# EAGLE design schematic_V3 (EAGLE 9.6.1)
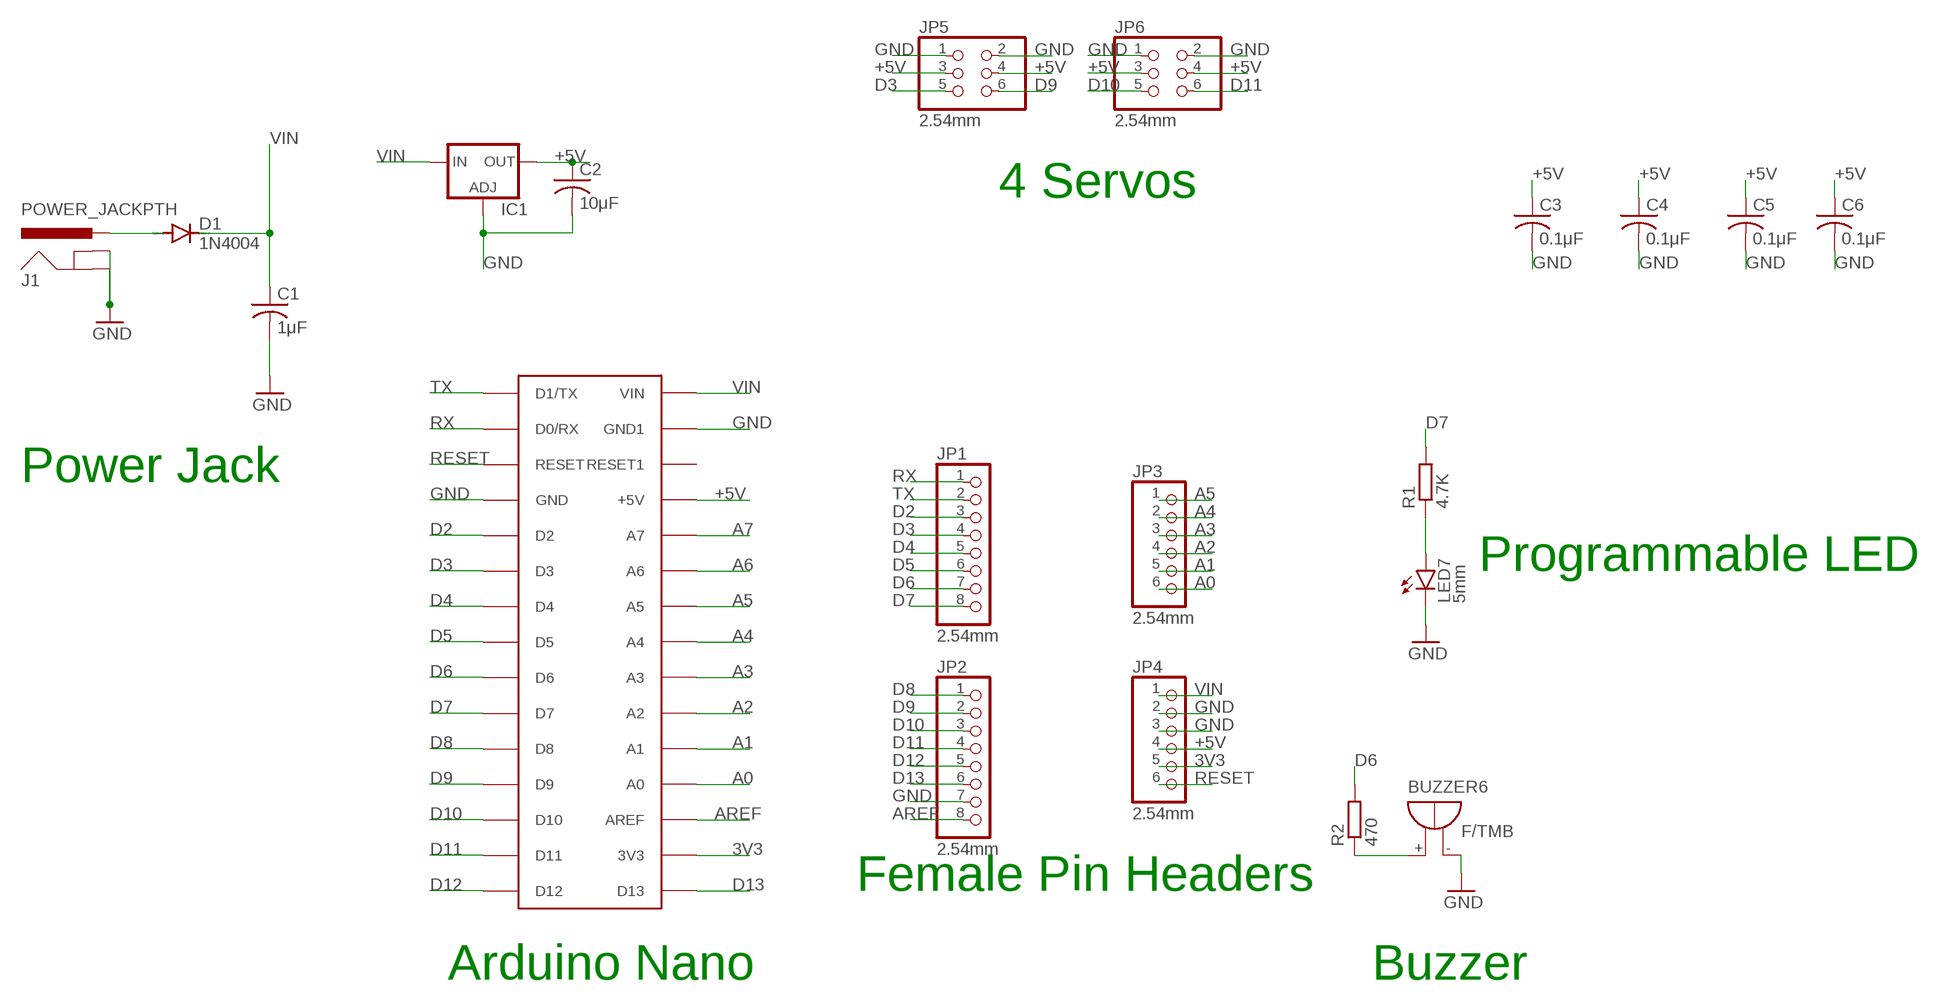
[diagram p0: schematic, sheet 1]

## Parts
BUZZER6  F/TMB  [F/TMB]
C1  1μF  C-USC1206  [C1206]
C2  10μF  C-USC1206  [C1206]
C3  0.1μF  C-USC1206  [C1206]
C4  0.1μF  C-USC1206  [C1206]
C5  0.1μF  C-USC1206  [C1206]
C6  0.1μF  C-USC1206  [C1206]
D1  1N4004  [DO41-10]
IC1  VR1  LD117AS33TR  [SOT223]
J1  POWER_JACKPTH  [POWER_JACK_PTH]
JP1  2.54mm  PINHD-1X8  [1X08]
JP2  2.54mm  PINHD-1X8  [1X08]
JP3  2.54mm  PINHD-1X6  [1X06]
JP4  2.54mm  PINHD-1X6  [1X06]
JP5  2.54mm  PINHD-2X3  [2X03]
JP6  2.54mm  PINHD-2X3  [2X03]
LED7  5mm  LED5MM  [LED5MM]
R1  4.7K  R-EU_0207/10  [0207/10]
R2  470  R-EU_0207/10  [0207/10]
U$1  ARDUINONANO  [PDIP-32]

## Nets
3V3: JP4.5 U$1.3V3
+5V: C2.1 C3.1 C4.1 C5.1 C6.1 IC1.4(OUT) JP4.4 JP5.3 JP5.4 JP6.3 JP6.4 U$1.+5V
A0: JP3.6 U$1.A7(A0)
A1: JP3.5 U$1.A6(A1)
A2: JP3.4 U$1.A5(A2)
A3: JP3.3 U$1.A4(A3)
A4: JP3.2 U$1.A3(A4)
A5: JP3.1 U$1.A2(A5)
A6: U$1.A1(A6)
A7: U$1.A0(A7)
AREF: JP2.8 U$1.AREF
D2: JP1.3 U$1.D2
D3: JP1.4 JP5.5 U$1.D3
D4: JP1.5 U$1.D4
D5: JP1.6 U$1.D5
D6: JP1.7 R2.2 U$1.D6
D7: JP1.8 R1.2 U$1.D7
D8: JP2.1 U$1.D8
D9: JP2.2 JP5.6 U$1.D9
D10: JP2.3 JP6.5 U$1.D10
D11: JP2.4 JP6.6 U$1.D11
D12: JP2.5 U$1.D12
D13: JP2.6 U$1.D13
GND: BUZZER6.- C1.2 C2.2 C3.2 C4.2 C5.2 C6.2 IC1.1(ADJ) J1.GND J1.GNDBREAK JP2.7 JP4.2 JP4.3 JP5.1 JP5.2 JP6.1 JP6.2 LED7.K(C) U$1.GND U$1.GND1
N$1: LED7.A R1.1
N$2: D1.A J1.PWR
N$4: BUZZER6.+ R2.1
RESET: JP4.6 U$1.RESET
RX: JP1.1 U$1.D0/RX
TX: JP1.2 U$1.D1/TX
VIN: C1.1 D1.C IC1.3(IN) JP4.1 U$1.VIN
Unconnected: U$1.RESET1

## Notes on the sheet
- 4 Servos
- Power Jack
- Programmable LED
- Female Pin Headers
- Arduino Nano | Buzzer

## Library data of the parts
BUZZER6 = buzzer:F/TMB: BUZZER Source: Buerklin; OC_FARNELL: unknown; OC_NEWARK: unknown
C1-C6 = adafruit:C-US: CAPACITOR, American symbol
D1 = diode:1N4004: DIODE general purpose rectifier, 1 A
IC1 = v-reg:LD117A?*: Low drop fixed and adjustable positive voltage regulators 1 A Source: http://www.st.com/stonline/products/literature/ds/7194/ld1117axx.pdf
J1 = SparkFun:POWER_JACK: Power Jack This is the standard 5.5mm barrel jack for power. The PTH is the most common, proven, reliable, footprint. All others are experimental. The Slot footprint only works if the mill layer is transmitted to the PCB fab house so be warned. Spark Fun Electronics SKU : PRT-00119. Mating wall wart : TOL-00298 (and others)
JP1 JP2 = pinhead:PINHD-1X8: PIN HEADER
JP3 JP4 = pinhead:PINHD-1X6: PIN HEADER
JP5 JP6 = pinhead:PINHD-2X3: PIN HEADER
LED7 = led:LED: LED OSRAM: - CHIPLED LG R971, LG N971, LY N971, LG Q971, LY Q971, LO R971, LY R971 LH N974, LH R974 LS Q976, LO Q976, LY Q976 LO Q996 - Hyper CHIPLED LW Q18S LB Q993, LB Q99A, LB R99A - SideLED LS A670, LO A670, LY A670, LG A670, LP A670 LB A673, LV A673, LT A673, LW A673 LH A674 LY A675 LS A676, LA A676, LO A676, LY A676, LW A676 LS A679, LY A679, LG A679 - Hyper Micro SIDELED® LS Y876, LA Y876, LO Y876, LY Y876 LT Y87S - SmartLED LW L88C, LW L88S LB L89C, LB L89S, LG L890 LS L89K, LO L89K, LY L89K LS L896, LA L896, LO L896, LY L896 - TOPLED LS T670, LO T670, LY T670, LG T670, LP T670 LSG T670, LSP T670, LSY T670, LOP T670, LYG T670 LG T671, LOG T671, LSG T671 LB T673, LV T673, LT T673, LW T673 LH T674 LS T676, LA T676, LO T676, LY T676, LB T676, LH T676, LSB T676, LW T676 LB T67C, LV T67C, LT T67C, LS T67K, LO T67K, LY T67K, LW E67C LS E67B, LA E67B, LO E67B, LY E67B, LB E67C, LV E67C, LT E67C LW T67C LS T679, LY T679, LG T679 LS T770, LO T770, LY T770, LG T770, LP T770 LB T773, LV T773, LT T773, LW T773 LH T774 LS E675, LA E675, LY E675, LS T675 LS T776, LA T776, LO T776, LY T776, LB T776 LHGB T686 LT T68C, LB T68C - Hyper Mini TOPLED® LB M676 - Mini TOPLED Santana® LG M470 LS M47K, LO M47K, LY M47K Source: http://www.osram.convergy.de LUXEON: - LUMILED® LXK2-PW12-R00, LXK2-PW12-S00, LXK2-PW14-U00, LXK2-PW14-V00 LXK2-PM12-R00, LXK2-PM12-S00, LXK2-PM14-U00 LXK2-PE12-Q00, LXK2-PE12-R00, LXK2-PE12-S00, LXK2-PE14-T00, LXK2-PE14-U00 LXK2-PB12-K00, LXK2-PB12-L00, LXK2-PB12-M00, LXK2-PB14-N00, LXK2-PB14-P00, LXK2-PB14-Q00 LXK2-PR12-L00, LXK2-PR12-M00, LXK2-PR14-Q00, LXK2-PR14-R00 LXK2-PD12-Q00, LXK2-PD12-R00, LXK2-PD12-S00 LXK2-PH12-R00, LXK2-PH12-S00 LXK2-PL12-P00, LXK2-PL12-Q00, LXK2-PL12-R00 Source: www.luxeon.com KINGBRIGHT: KA-3528ASYC Source: www.kingbright.com
R1 R2 = rcl:R-EU_: RESISTOR, European symbol; SPICEPREFIX: R
U$1 = rocketfarm:ARDUINONANO

## Board
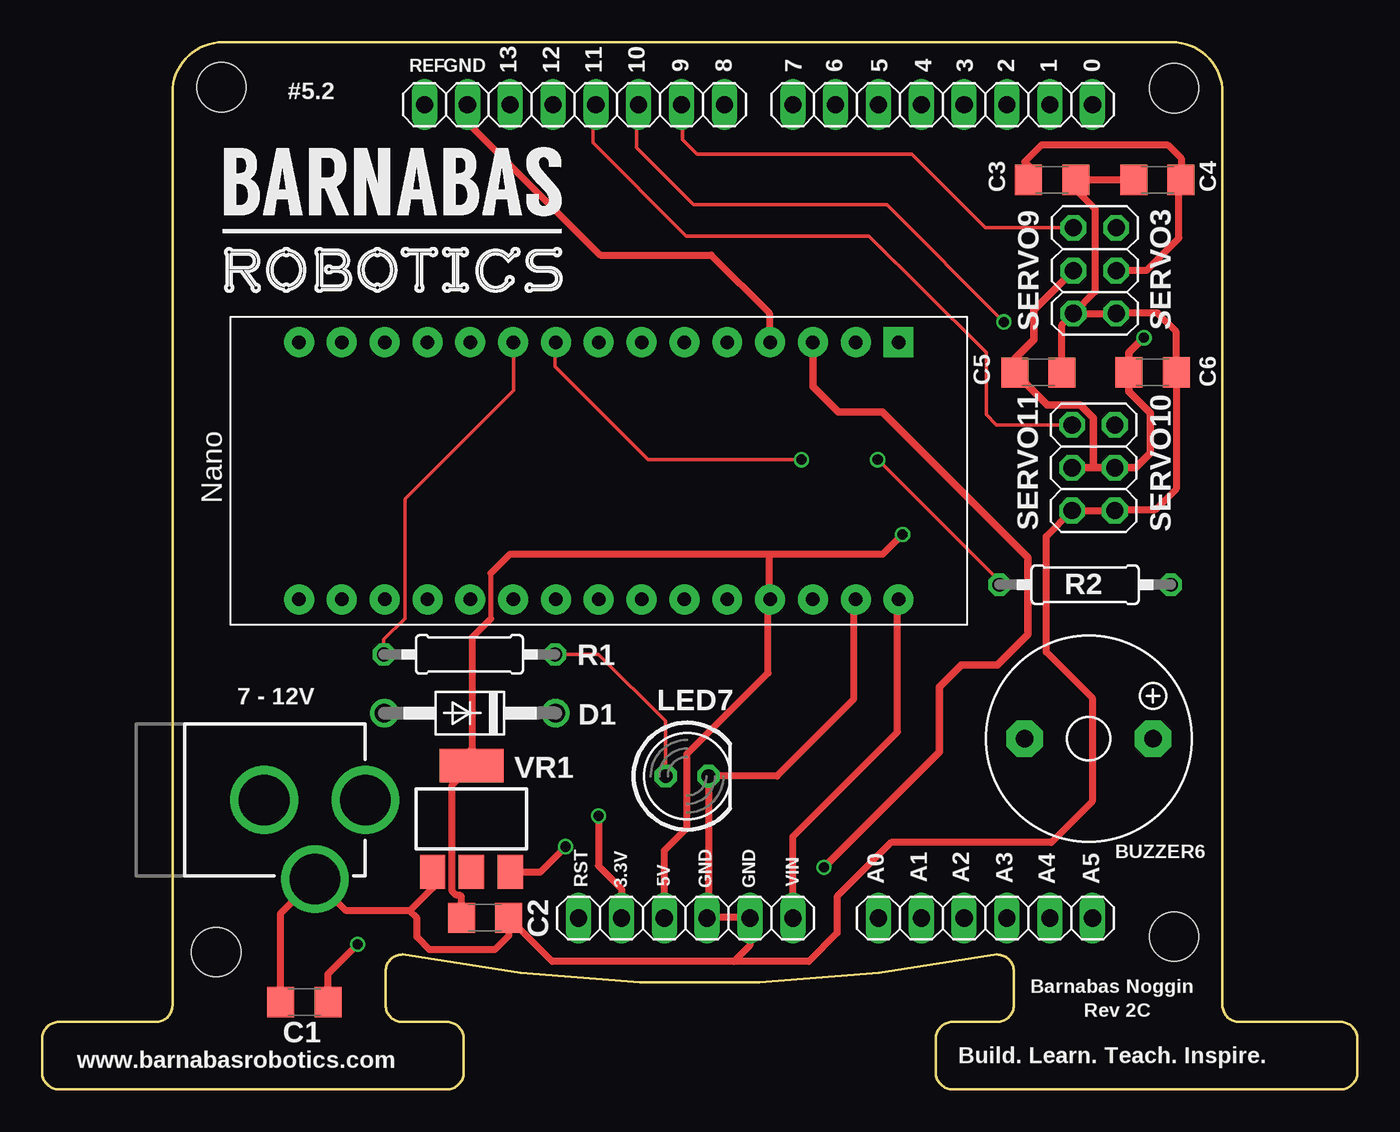
[diagram p1: board, top side]
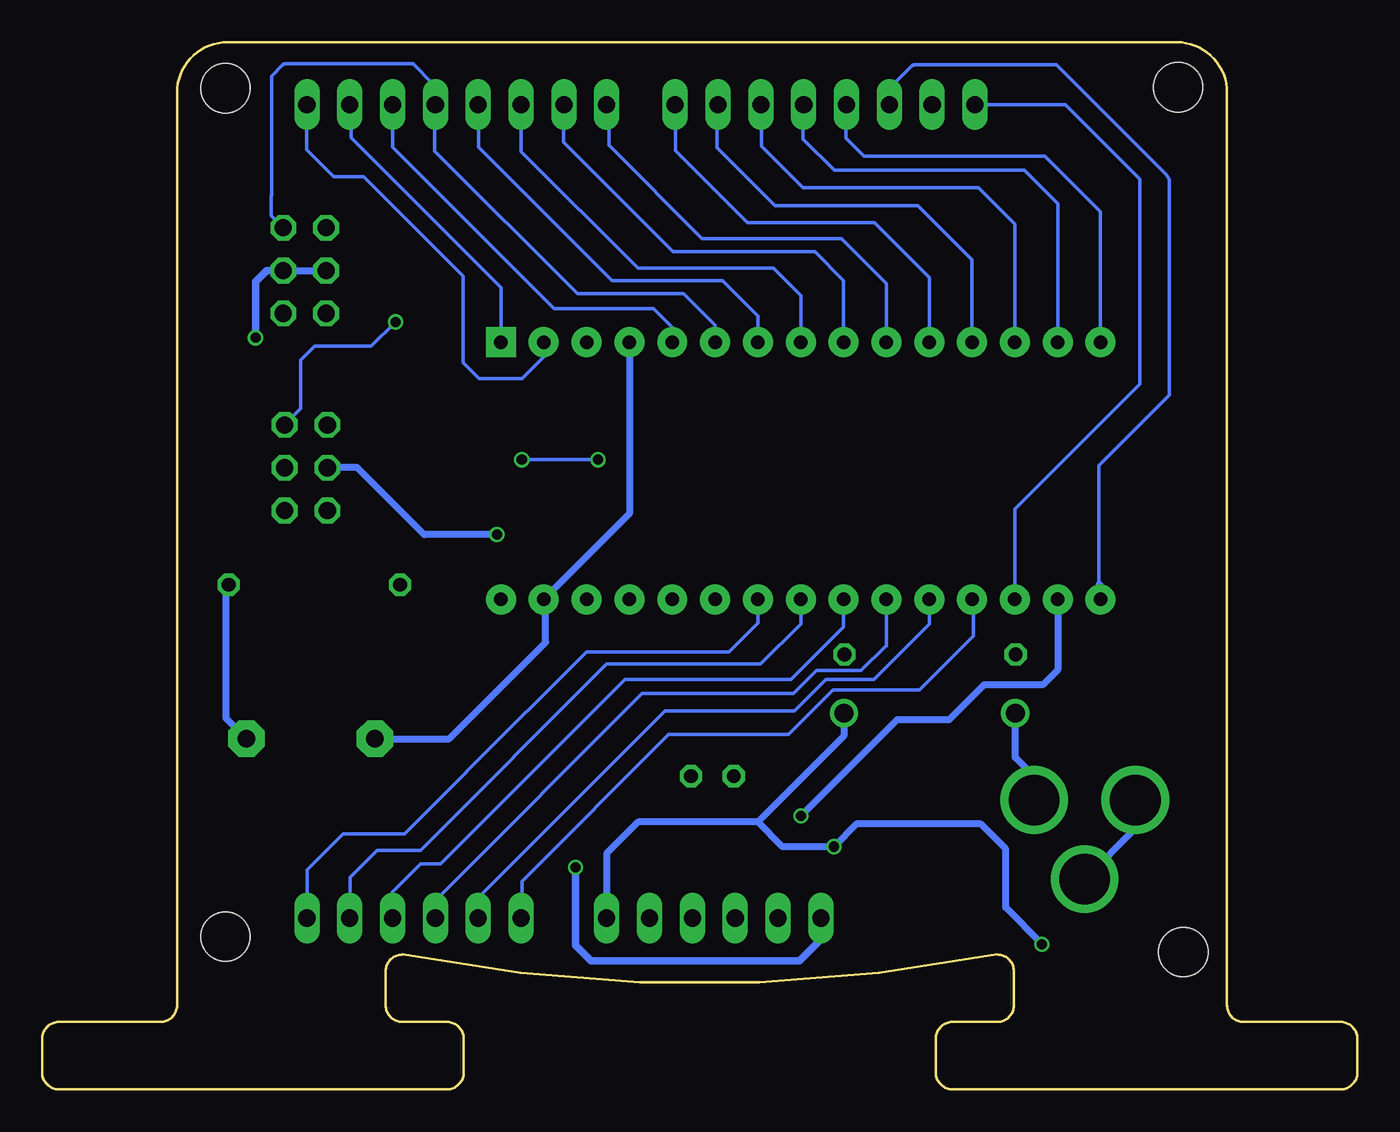
[diagram p2: board, bottom side, seen from below]

Size 78 x 62.12 mm. Coordinates in mm from the lower left corner, seen from the top.
Outline: 57.63,7 57.63,5 arc-90 56.63,4 54,4 arc90 53,3 53,1 arc90 54,0 77,0 arc90 78,1 78,3 arc90 77,4 71,4 arc-90 70,5 70,59.12 arc90 67,62.12 10.73,62.12 arc90 7.73,59.12 7.73,5 arc-90 6.73,4 1,4 arc90 0,3 0,1 arc90 1,0 24,0 arc90 25,1 25,3 arc90 24,4 21.37,4 arc-90 20.37,5 20.37,7 arc-90 21.37,8 arc22 56.63,8 arc-90 57.63,7
Copper layers (1*16): Top 0.035mm / dielectric 1.5mm / Bottom 0.035mm
Design rules "EagleRules": minimum track width 7mil, minimum drill 12mil, track to track 7mil, track to pad 7mil, pad to pad 7mil, via to via 7mil, smd to smd 0mil, copper to edge 20mil, drill to drill 10mil, minimum pad ring 10mil, minimum via ring 6mil, stop-mask expansion 2mil, vias tented up to drill 25mil, thermal gap 10mil
Holes 2.9 mm at 10.64,59.44 67.14,59.38 67.14,9.06 10.32,8.13

### Footprints (pad centres in the part's own frame; a part is rotated, then mirrored left to right if it is on the bottom)
F/TMB = drill 1.016 pad 2.159 octagon: + 3.81,0; - -3.81,0
C1206 = smd 1.6 x 1.8: 1 -1.4,0; 2 1.4,0
DO41-10 = drill 1.118: A 5.08,0; C -5.08,0
SOT223 = smd 1.5 x 2: 1 -2.3,-3.15; 2 0,-3.15; 3 2.3,-3.15 | smd 3.8 x 2: 4 0,3.15
POWER_JACK_PTH = drill 2.997: GND 0,7.7; GNDBREAK 4.7,10.7; PWR 0,13.7
1X08 = drill 1.016 long: 1 -8.89,0; 2 -6.35,0; 3 -3.81,0; 4 -1.27,0; 5 1.27,0; 6 3.81,0; 7 6.35,0; 8 8.89,0
1X06 = drill 1.016 long: 1 -6.35,0; 2 -3.81,0; 3 -1.27,0; 4 1.27,0; 5 3.81,0; 6 6.35,0
2X03 = drill 1.016 octagon: 1 -2.54,-1.27; 2 -2.54,1.27; 3 0,-1.27; 4 0,1.27; 5 2.54,-1.27; 6 2.54,1.27
LED5MM = drill 0.813 octagon: A -1.27,0; K 1.27,0
0207/10 = drill 0.813 octagon: 1 -5.08,0; 2 5.08,0
PDIP-32 = drill 0.8 pad 1.778: 3V3 15.24,-35.56; +5V 15.24,-10.16; A0 15.24,-12.7; A1 15.24,-15.24; A2 15.24,-17.78; A3 15.24,-20.32; A4 15.24,-22.86; A5 15.24,-25.4; A6 15.24,-27.94; A7 15.24,-30.48; AREF 15.24,-33.02; D0/RX 0,-5.08; D2 0,-12.7; D3 0,-15.24; D4 0,-17.78; D5 0,-20.32; D6 0,-22.86; D7 0,-25.4; D8 0,-27.94; D9 0,-30.48; D10 0,-33.02; D11 0,-35.56; D12 0,-38.1; D13 15.24,-38.1; GND 0,-10.16; GND1 15.24,-5.08; RESET 0,-7.62; RESET1 15.24,-7.62; VIN 15.24,-2.54 | drill 0.8 pad 1.778 square: D1/TX 0,-2.54

### Placement (x,y rotation side)
BUZZER6  62.07,20.8 0 top
C1  15.55,5.19 180 top
C2  26.26,10.18 0 top
C3  59.89,53.95 0 top
C4  66.14,53.95 180 top
C5  59.09,42.52 0 top
C6  65.86,42.52 0 top
D1  25.37,22.32 180 top
IC1  25.46,16.05 0 top
J1  5.47,17.17 270 top
JP1  53.41,58.41 180 top
JP2  31.57,58.41 180 top
JP3  55.95,10.16 180 top
JP4  38.17,10.16 180 top
JP5  62.43,48.57 90 top
JP6  62.35,36.87 90 top
LED7  38.25,18.58 0 top
R1  25.34,25.8 180 top
R2  61.86,29.94 180 top
U$1  53.33,44.31 270 top

### Tracks (layer width: path | path; a pad name or v marks a point on that pad's centre or on a via)
3V3  (via drill 0.6)
  Top 0.406: v33,16.23 33,13.26 34.35,11.91 JP4.5
  Bottom 0.406: U$1.3V3 17.77,24.89 18.66,24 22.14,24 24.22,21.92 27.3,21.92 30.73,18.49 v33,16.23
+5V  (via drill 0.6)
  Top 0.203: 58.66,53.95 58.76,53.85 | C5.1 57.69,42.38 | 65.72,37.74 65.73,37.75 | 61.08,36.95 JP6.4
  Top 0.305: 26.62,27.93 26.62,30.63
  Top 0.406: JP4.4 36.9,14.17 38.24,15.51 38.24,19.89 43.05,24.69 43.05,28.95 U$1.+5V 43.13,29.11 43.13,31.75 | 26.62,27.93 25.5,26.8 25.5,20.23 24.92,19.66 24.92,18.66 | 26.62,30.63 27.74,31.75 43.13,31.75 | 43.13,31.75 49.86,31.75 v51.03,32.91 | 58.76,53.85 58.48,53.85 58.27,54.05 | 58.27,55.01 59.28,56.02 66.75,56.02 67.55,55.22 C4.1 67.42,53.83 67.42,50.5 65.49,48.57 JP5.3 | C2.1 24.86,11.44 24.78,11.52 24.55,11.52 24.33,11.74 24.33,18.06 24.92,18.66 | 58.27,55.01 58.27,54.05 | 58.27,54.05 58.39,54.05 C3.1 58.49,54.79 58.27,55.01 | IC1.4 24.92,18.66
  Top 0.45: JP6.4 62.34,36.87 | 62.34,36.87 JP6.3 64.85,36.87 65.72,37.74 | 65.73,37.75 65.73,40.13 64.46,41.4 C6.1 64.46,43.7 v65.34,44.58 | JP5.4 58.81,46.22 58.81,44.47 57.69,43.35 57.69,42.38 | C5.1 59.63,40.58 61.56,40.58 62.34,39.8 62.34,36.87
  Bottom 0.203: 65.34,47.9 64.78,48.47 | 64.68,48.57 64.78,48.47 | 64.78,48.47 63.8,48.47 JP5.3
  Bottom 0.406: v51.03,32.91 55.35,32.91 59.33,36.9 61.05,36.9 JP6.4 | JP5.3 JP5.4
  Bottom 0.45: v65.34,44.58 65.34,47.9 64.68,48.57 JP5.3
A0
  Bottom 0.203: U$1.A7 22.85,28.82 | JP3.6 49.54,10.22 49.54,12.35 40.87,21.02 40.84,21.05 40.83,21.06 33.73,21.06 31.11,23.69 25.96,23.69 22.77,26.88 22.77,28.5 22.8,28.54 22.8,28.87 22.85,28.82 | 22.85,28.68 22.85,28.82
A1
  Bottom 0.203: U$1.A6 25.39,27.59 28.68,24.3 31.52,24.3 33.39,22.44 41.05,22.44 41.06,22.45 52.04,11.47 52.04,10.26 JP3.5
A2
  Bottom 0.203: U$1.A5 27.93,26.31 27.97,26.31 29.44,24.84 32.08,24.84 33.44,23.48 42.41,23.48 54.4,11.48 54.4,10.44 JP3.4
A3
  Bottom 0.203: U$1.A4 30.47,27.43 33.59,24.32 43.42,24.32 54.36,13.38 55.56,13.38 57.22,11.72 JP3.3
A4
  Bottom 0.203: U$1.A3 33.01,27.6 35.39,25.23 44.53,25.23 55.56,14.19 58.13,14.19 59.74,12.58 59.74,10.19 JP3.2
A5
  Bottom 0.203: U$1.A2 35.55,27.65 37.26,25.95 45.72,25.95 52.82,18.85 52.82,18.84 56.5,15.16 60.15,15.16 62.29,13.02 JP3.1
AREF
  Bottom 0.203: U$1.AREF 20.31,34.43 12.91,41.83 12.91,54 17.33,58.41 JP2.8
  Bottom 0.406: JP2.8
D2
  Bottom 0.203: U$1.D2 40.63,45.21 41.74,46.32 47.65,46.32 57.21,55.88 57.21,58.4
  Bottom 0.406: 57.21,58.4 JP1.3
D3
  Bottom 0.203: U$1.D3 38.09,45.32 39.96,47.19 46.25,47.19 54.72,55.66 54.72,58.38 | 54.79,59.6 56.02,60.82 63.6,60.82 arc-45 63.73,60.77 64.4,60.1 64.4,53.01 64.41,53 64.41,51.81 JP5.5
  Bottom 0.406: 54.72,58.38 JP1.4 54.79,58.53 54.79,59.6
D4
  Bottom 0.203: U$1.D4 35.55,45.88 37.64,47.96 44.21,47.96 52.12,55.87 52.12,58.4
  Bottom 0.406: 52.12,58.4 JP1.5
D5
  Bottom 0.203: U$1.D5 33.01,47.08 34.64,48.7 42.67,48.7 49.59,55.62 JP1.6
  Bottom 0.406: JP1.6
D6  (via drill 0.6)
  Top 0.203: R2.2 56.97,29.94 v49.55,37.35 | v45.04,37.35 35.94,37.35 30.43,42.86 30.43,44.27 U$1.D6
  Bottom 0.203: U$1.D6 30.47,47.97 32.18,49.68 40.58,49.68 47.08,56.18 47.08,58.39 | v49.55,37.35 v45.04,37.35
  Bottom 0.406: 47.08,58.39 JP1.7
D7
  Top 0.203: R1.2 20.26,26.69 21.51,27.94 21.51,35.01 27.95,41.45 27.95,44.29 U$1.D7
  Bottom 0.203: U$1.D7 27.93,47.8 30.6,50.47 38.86,50.47 44.39,55.99 44.39,58.29
  Bottom 0.406: 44.39,58.29 JP1.8
D8
  Bottom 0.203: U$1.D8 25.39,48.14 28.65,51.4 36.17,51.4 40.44,55.67 40.44,58.4
  Bottom 0.406: 40.44,58.4 JP2.1
D9
  Top 0.203: 37.98,58.35 37.98,56.34 38.85,55.47 51.59,55.47 55.93,51.13 61.14,51.13 JP5.6
  Top 0.406: 37.98,58.35 JP2.2
  Bottom 0.203: U$1.D9 22.85,49.23 26.05,52.42 34.55,52.42 37.98,55.86 37.98,58.35
  Bottom 0.406: 37.98,58.35 JP2.2
D10  (via drill 0.6)
  Top 0.203: 35.24,57.82 35.24,55.86 38.63,52.46 50.09,52.46 v57.03,45.52
  Top 0.406: 35.24,57.82 35.34,57.91 35.34,58.37 JP2.3
  Bottom 0.203: U$1.D10 20.31,51.33 22.47,53.49 32.87,53.49 35.34,55.95 35.34,58.37 | v57.03,45.52 57.05,45.52 58.49,44.08 61.85,44.08 62.66,43.27 62.66,40.37 JP6.5
  Bottom 0.406: 35.34,58.37 JP2.3
D11
  Top 0.203: JP6.6 56.6,39.41 55.99,40.02 55.99,43.71 55.73,43.98 49.03,50.61 38.2,50.61 32.66,56.15 32.66,58.23
  Top 0.406: 32.66,58.23 JP2.4
  Bottom 0.203: U$1.D11 17.77,52.55 19.73,54.51 31.02,54.51 32.87,56.37 32.87,58.38
  Bottom 0.406: 32.87,58.38 JP2.4
D12
  Bottom 0.203: U$1.D12 15.23,52.05 18.53,55.35 29.25,55.35 30.32,56.42 30.32,58.39
  Bottom 0.406: 30.32,58.39 JP2.5
D13
  Bottom 0.203: 15.32,29.97 15.32,37.02 11.14,41.19 11.14,53.8 arc-45 11.33,54.25 17.85,60.77 26.23,60.77 arc-45 26.46,60.67 | 26.39,60.74 26.46,60.67 | 26.46,60.67 27.78,59.35
  Bottom 0.406: U$1.D13 15.23,29.88 15.32,29.97 | 27.78,59.35 27.78,58.44 JP2.6
GND
  Top 0.203: 43.12,44.36 U$1.GND | C3.2 61.29,53.78 61,53.49 | 63.66,34.37 JP6.1 | 63.73,46.06 JP5.1
  Top 0.406: U$1.GND1 48.14,28.96 48.14,23.14 43.59,18.59 39.54,18.59 LED7.K 39.52,10.25 | JP2.7 25.22,57.35 33.08,49.48 39.67,49.48 43.12,46.03 43.12,44.36 | C3.2 C4.2 | 61,53.49 61.2,53.49 62.44,52.25 62.44,47.31 JP5.2 | C1.2 14.15,10.46 J1.GNDBREAK 18.04,10.59 21.81,10.59 | IC1.1 23.16,11.95 21.81,10.59 | 41.04,7.6 45.47,7.6 47.14,9.27 47.14,11.44 50.35,14.64 59.84,14.64 62.28,17.08 62.28,23.23 59.55,25.96 59.55,25.92 59.55,32.8 JP6.2 JP6.1 | 41.04,7.6 30.24,7.6 C2.2 27.66,9.11 26.84,8.29 22.98,8.29 22.23,9.04 22.23,10.18 21.81,10.59 | 41.04,7.6 41.98,8.54 JP4.2 41.89,10.25 39.52,10.25 | 63.66,34.37 66.02,34.37 67.26,35.61 C6.2 67.26,44.94 66.14,46.06 63.73,46.06 | JP5.2 JP5.1 | C5.2 60.49,45.35 JP5.2 | 39.52,10.25 JP4.3
  Bottom 0.406: U$1.GND 43.17,34.15 U$1.GND1 48.14,28.96 48.14,26.52 53.85,20.8 BUZZER6.- | J1.GND 13.17,15.47 J1.GNDBREAK
N$1
  Top 0.203: R1.1 33,25.8 36.96,21.84 36.96,18.6 LED7.A
N$2
  Bottom 0.406: J1.PWR 19.17,18.56 20.28,19.68 D1.A
N$4
  Bottom 0.406: R2.1 67.11,29.77 67.11,22.02 BUZZER6.+
RESET  (via drill 0.6)
  Top 0.45: U$1.RESET 45.71,41.69 47.23,40.17 49.83,40.17 58.45,31.55 58.45,26.98 56.65,25.18 54.51,25.18 53.2,23.87 53.2,20.02 v46.36,13.17
  Bottom 0.45: v46.36,13.17 46.36,8.54 45.44,7.61 33.09,7.61 31.81,8.9 31.81,10.15 JP4.6
RX
  Bottom 0.203: U$1.D0/RX 48.25,43.43 49.53,42.15 52.08,42.15 53.04,43.12 53.04,48.24 58.94,54.14 60.71,54.14 62.32,55.75 62.32,58.39
  Bottom 0.406: 62.32,58.39 JP1.1
TX
  Bottom 0.203: U$1.D1/TX 50.79,47.56 59.68,56.46 59.68,58.34
  Bottom 0.406: 59.68,58.34 JP1.2
VIN  (via drill 0.6)
  Top 0.406: JP4.1 44.52,15.01 50.73,21.22 50.73,29.01 U$1.VIN | IC1.3 29.55,12.9 v31.05,14.4 | C1.1 16.95,6.85 v18.7,8.6
  Bottom 0.406: D1.C 30.45,20.96 35.55,15.86 | 35.55,15.86 42.66,15.86 44.52,14 JP4.1 | 35.55,15.86 34.09,14.4 v31.05,14.4 29.71,15.74 22.33,15.74 20.85,14.26 20.85,10.79 18.7,8.64 v18.7,8.6

### Text on the board
tPlace: 13 | 12 | 11 | 10 | GND | REF | 9 | 8 | 7 | 6 | 5 | 4 | 3 | 2 | 1 | 0 | #5.2 | SERVO9 | SERVO3 | SERVO11 | SERVO10 | 7 - 12V | VR1 | RST | 3.3V | 5V | GND | GND | VIN | A0 | A1 | A2 | A3 | A4 | A5 | Barnabas Noggin | Rev 2C | Build. Learn. Teach. Inspire. | www.barnabasrobotics.com